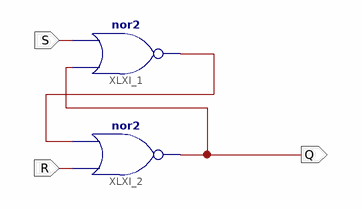
[diagram p0: schematic sheet 1]
// Xilinx ISE schematic RSLatch.sch (kintex7) as structural Verilog: 2 symbols, 3 ports
module RSLatch (
  input  S,
  input  R,
  output Q
);

  wire XLXN_2;

  nor XLXI_1 (XLXN_2, Q, S);
  nor XLXI_2 (Q, R, XLXN_2);
endmodule
